# EAGLE design PulseOx (EAGLE 7.1.0)
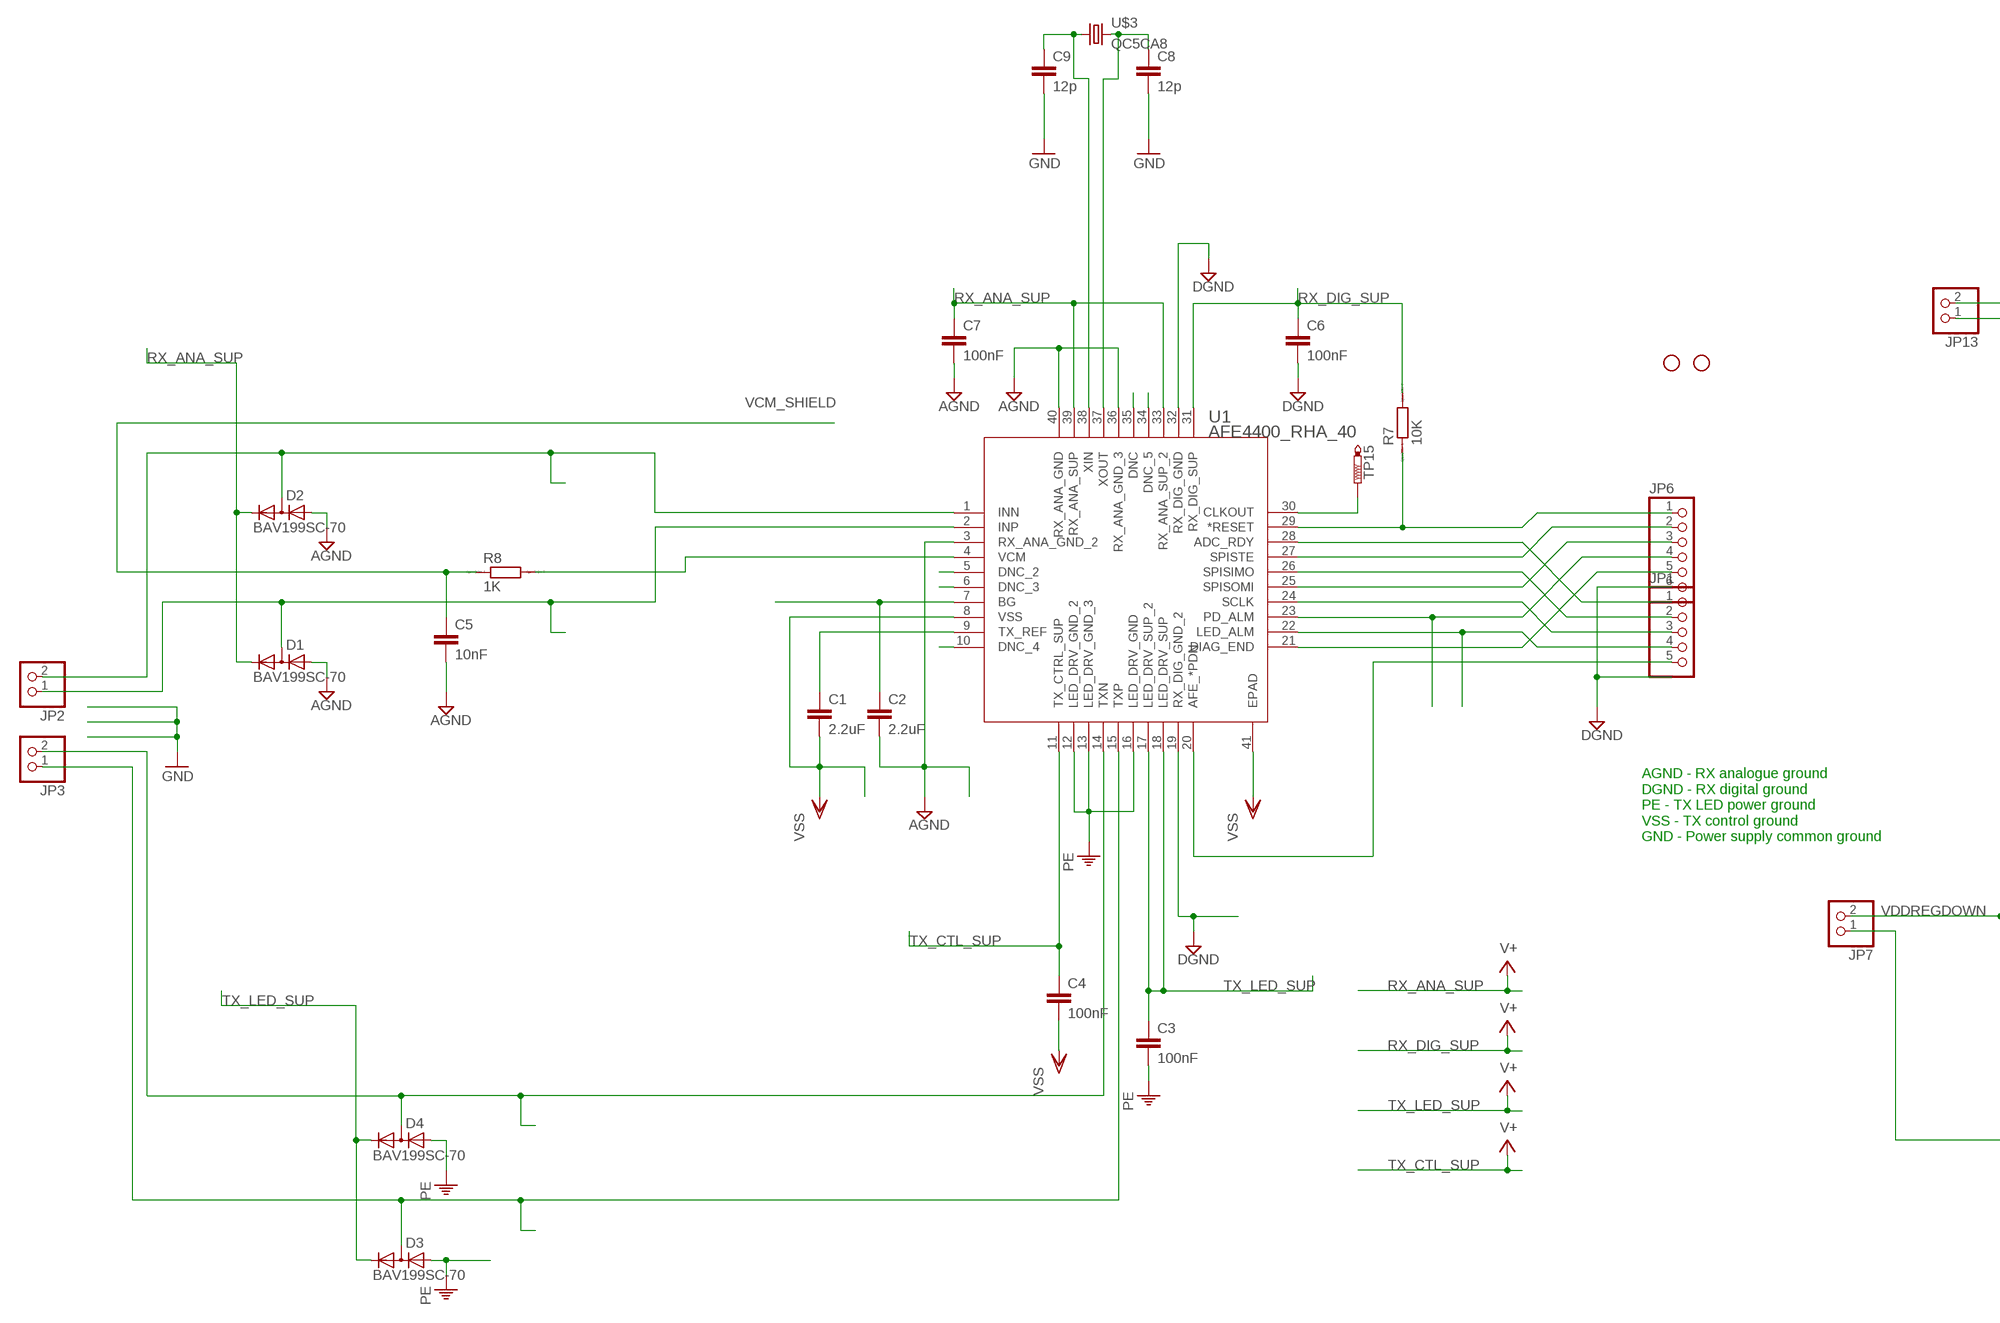
[diagram p0: schematic, sheet 1, part 1 of 2]
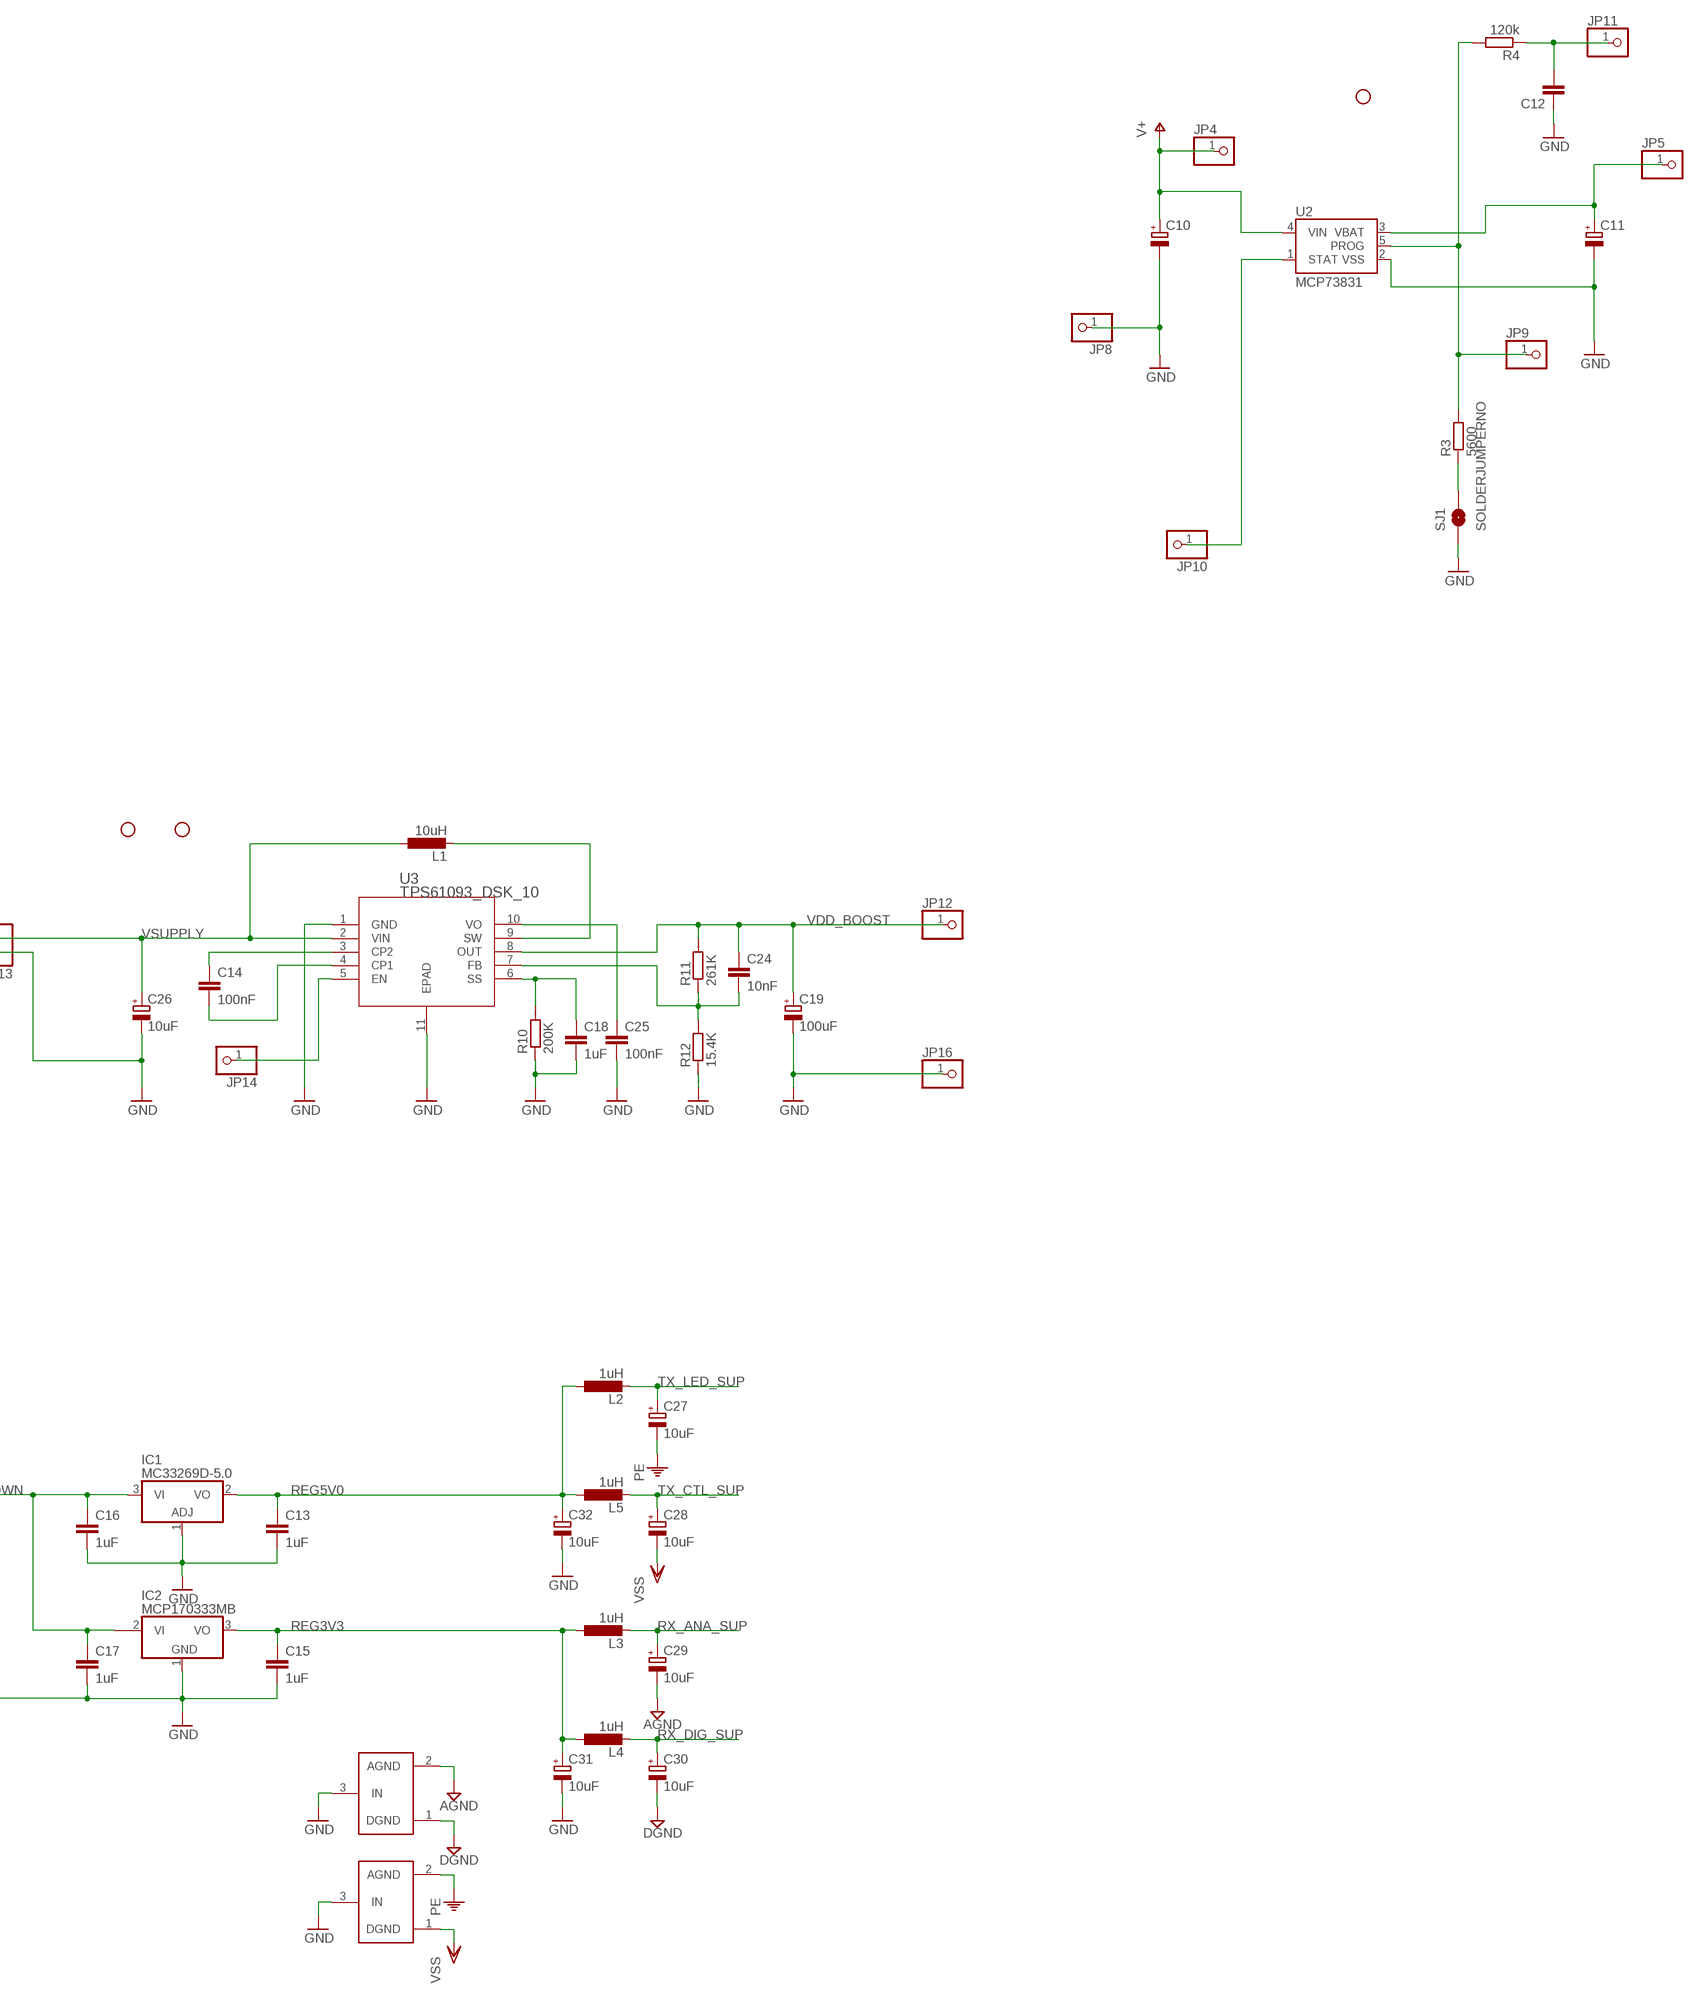
[diagram p1: schematic, sheet 1, part 2 of 2]

## Parts
C1  2.2uF  C-EUC1206K  [C1206K]
C2  2.2uF  C-EUC1206K  [C1206K]
C3  100nF  C-EUC1206K  [C1206K]
C4  100nF  C-EUC1206K  [C1206K]
C5  10nF  C-EUC0603K  [C0603K]
C6  100nF  C-EUC1206K  [C1206K]
C7  100nF  C-EUC1206K  [C1206K]
C8  12p  C-EUC0603K  [C0603K]
C9  12p  C-EUC0603K  [C0603K]
C10  CPOL-EUE2.5-6  [E2,5-6]
C11  CPOL-EUE2.5-6  [E2,5-6]
C12  C-EUC1206  [C1206]
C13  1uF  C-EUC1206K  [C1206K]
C14  100nF  C-EUC1206K  [C1206K]
C15  1uF  C-EUC1206K  [C1206K]
C16  1uF  C-EUC1206K  [C1206K]
C17  1uF  C-EUC1206K  [C1206K]
C18  1uF  C-EUC1206K  [C1206K]
C19  100uF  CPOL-EUTT2D5  [TT2D5]
C24  10nF  C-EUC0603K  [C0603K]
C25  100nF  C-EUC1206K  [C1206K]
C26  10uF  CPOL-EUTT2D5  [TT2D5]
C27  10uF  CPOL-EUTT2D5  [TT2D5]
C28  10uF  CPOL-EUTT2D5  [TT2D5]
C29  10uF  CPOL-EUTT2D5  [TT2D5]
C30  10uF  CPOL-EUTT2D5  [TT2D5]
C31  10uF  CPOL-EUTT2D5  [TT2D5]
C32  10uF  CPOL-EUTT2D5  [TT2D5]
D1  BAV199SC-70  [SC-70]
D2  BAV199SC-70  [SC-70]
D3  BAV199SC-70  [SC-70]
D4  BAV199SC-70  [SC-70]
IC1  MC33269D-5.0  [DPACK]
IC2  MCP170333MB  [SOT89]
JP1  PINHD-1X5  [1X05]
JP2  PINHD-1X2  [1X02]
JP3  PINHD-1X2  [1X02]
JP4  PINHD-1X1  [1X01]
JP5  PINHD-1X1  [1X01]
JP6  PINHD-1X6  [1X06]
JP7  PINHD-1X2  [1X02]
JP8  PINHD-1X1  [1X01]
JP9  PINHD-1X1  [1X01]
JP10  PINHD-1X1  [1X01]
JP11  PINHD-1X1  [1X01]
JP12  PINHD-1X1  [1X01]
JP13  PINHD-1X2  [1X02]
JP14  PINHD-1X1  [1X01]
JP16  PINHD-1X1  [1X01]
L1  10uH  L-EUD53LC  [D53LC]
L2  1uH  L-EU  [L1515]
L3  1uH  L-EU  [L1515]
L4  1uH  L-EU  [L1515]
L5  1uH  L-EU  [L1515]
R3  5600  R-EU_R0402  [R0402]
R4  120k  R-EU_R0402  [R0402]
R7  10K  R-EU_R0805  [R0805]
R8  1K  R-EU_R0402  [R0402]
R10  200K  R-EU_R0603  [R0603]
R11  261K  R-EU_R0603  [R0603]
R12  15.4K  R-EU_R0603  [R0603]
SJ1  SOLDERJUMPERNO  [SJ_2S-NO]
STANDOFF1  STAND-OFF  [STAND-OFF]
STANDOFF2  STAND-OFF  [STAND-OFF]
STANDOFF3  STAND-OFF  [STAND-OFF]
STANDOFF4  STAND-OFF  [STAND-OFF]
STANDOFF5  STAND-OFF  [STAND-OFF]
TP15  PTR1TP12R  [TP12R]
U1  AFE4400_RHA_40  [RHA40_4P15X4P15]
U2  MCP73831  [SOT23-5]
U3  TPS61093_DSK_10  [DSK10_2X1P2]
U$1  GND_CONNECT  [GND_CONNECT]
U$2  GND_CONNECT  [GND_CONNECT]
U$3  QC5CA8  [QC5CA]

## Nets
AFE_PDN: JP1.5 U1.20(AFE_*PDN)
AGND: C2.2 C5.2 C7.2 C29.- D1.2(A) D2.2(A) U1.3(RX_ANA_GND_2) U1.36(RX_ANA_GND_3) U1.40(RX_ANA_GND) U$1.2(AGND)
DGND: C6.2 C30.- JP6.6 U1.19(RX_DIG_GND_2) U1.32(RX_DIG_GND) U$1.1(DGND)
GND: C8.2 C9.2 C13.2 C15.2 C16.2 C17.2 C31.- C32.- IC1.1(ADJ) IC2.1(GND) JP7.1 U$1.3(IN) U$2.3(IN)
GND1: C10.- C11.- C12.1 JP8.1 SJ1.1 U2.2(VSS) ; supply symbol labelled GND
GND2: C18.2 C19.- C25.2 C26.- JP13.1 JP16.1 R10.1 R12.1 U3.1(GND) U3.11(EPAD) ; supply symbol labelled GND
INN: D2.3(AC) JP2.2 U1.1(INN)
INP: D1.3(AC) JP2.1 U1.2(INP)
N$1: C2.1 U1.7(BG)
N$2: U1.5(DNC_2)
N$3: U1.6(DNC_3)
N$4: U1.10(DNC_4)
N$5: U1.35(DNC)
N$6: U1.34(DNC_5)
N$7: TP15.TP U1.30(CLKOUT)
N$8: JP6.1 R7.1 U1.29(*RESET)
N$9: JP1.1 U1.28(ADC_RDY)
N$10: JP6.2 U1.27(SPISTE)
N$11: JP1.2 U1.26(SPISIMO)
N$12: JP6.3 U1.25(SPISOMI)
N$13: JP1.3 U1.24(SCLK)
N$14: JP6.4 U1.23(PD_ALM)
N$15: JP1.4 U1.22(LED_ALM)
N$16: JP6.5 U1.21(DIAG_END)
N$19: C1.1 U1.9(TX_REF)
N$23: JP10.1 U2.1(STAT)
N$24: JP9.1 R3.2 R4.2 U2.5(PROG)
N$25: C12.2 JP11.1 R4.1
N$26: R3.1 SJ1.2
N$27: C14.2 U3.4(CP1)
N$28: C14.1 U3.3(CP2)
N$29: L1.P$2 U3.9(SW)
N$30: C24.2 R11.1 R12.2 U3.7(FB)
N$31: C18.1 R10.2 U3.6(SS)
N$32: R8.2 U1.4(VCM)
N$33: C25.1 U3.10(VO)
N$35: JP14.1 U3.5(EN)
N$37: C9.1 U1.38(XIN) U$3.1
N$38: C8.1 U1.37(XOUT) U$3.3
PE: C3.2 C27.- D3.2(A) D4.2(A) U1.12(LED_DRV_GND_2) U1.13(LED_DRV_GND_3) U1.16(LED_DRV_GND) U$2.2(AGND)
REG3V3: C15.1 C31.+ IC2.3(VO) L3.1 L4.1
REG5V0: C13.1 C32.+ IC1.2(VO) L2.1 L5.1
RX_ANA_SUP: C7.1 C29.+ D1.1(C) D2.1(C) L3.2 U1.33(RX_ANA_SUP_2) U1.39(RX_ANA_SUP) ; supply symbol labelled V+
RX_DIG_SUP: C6.1 C30.+ L4.2 R7.2 U1.31(RX_DIG_SUP) ; supply symbol labelled V+
TX_CTL_SUP: C4.1 C28.+ L5.2 U1.11(TX_CTRL_SUP) ; supply symbol labelled V+
TX_LED_SUP: C3.1 C27.+ D3.1(C) D4.1(C) L2.2 U1.17(LED_DRV_SUP_2) U1.18(LED_DRV_SUP) ; supply symbol labelled V+
TXN: D4.3(AC) JP3.2 U1.14(TXN)
TXP: D3.3(AC) JP3.1 U1.15(TXP)
V+: C10.+ JP4.1 U2.4(VIN)
VBATT: C11.+ JP5.1 U2.3(VBAT)
VCM_SHIELD: C5.1 R8.1
VDD_BOOST: C19.+ C24.1 JP12.1 R11.2 U3.8(OUT)
VDDREGDOWN: C16.1 C17.1 IC1.3(VI) IC2.2@1(VI1) JP7.2
VSS: C1.2 C4.2 C28.- U1.8(VSS) U1.41(EPAD) U$2.1(DGND)
VSUPPLY: C26.+ JP13.2 L1.P$1 U3.2(VIN)
Unconnected: IC2.2(VI)

## Notes on the sheet
- AGND - RX analogue ground
  DGND - RX digital ground
  PE - TX LED power ground
  VSS - TX control ground
  GND - Power supply common ground

## Library data of the parts
C1-C9 C12-C18 C24 C25 = rcl:C-EU: CAPACITOR, European symbol
C10 C11 C19 C26-C32 = rcl:CPOL-EU: POLARIZED CAPACITOR, European symbol
D1-D4 = diode:BAV199: DIODE low-leakage double diode
IC1 = linear:MC33269?*: Adjustable Output Low Dropout Voltage Regulator 800 mA Source: http://www.onsemi.com/pub/Collateral/MC33269-D.PDF
IC2 = linear:MCP1703*: 250 mA, 16V, Low Quiescent Current LDO Regulator Source: http://ww1.microchip.com/downloads/en/DeviceDoc/22049b.pdf
JP1 = pinhead:PINHD-1X5: PIN HEADER
JP2 JP3 JP7 JP13 = pinhead:PINHD-1X2: PIN HEADER
JP4 JP5 JP8-JP12 JP14 JP16 = pinhead:PINHD-1X1: PIN HEADER
JP6 = pinhead:PINHD-1X6: PIN HEADER
L1-L5 = rcl:L-EU: INDUCTOR, European symbol
R3 R4 = rcl:R-EU_: RESISTOR, European symbol
R7 R8 R10-R12 = resistor:R-EU_: RESISTOR, European symbol; SPICEPREFIX: R
SJ1 = SparkFun:SOLDERJUMPER: Solder Jumper Standard SMD solder jumper. Used to automate production. Two varients : Normally Open and Normally Closed are the same, but have different paste layers. NC will have a large amount of paste and should jumper during reflow.
STANDOFF1-STANDOFF5 = SparkFun-Electromechanical:STAND-OFF: #4 Stand Off This is the mechanical footprint for a #4 phillips button head screw. Use the keepout ring to avoid running the screw head into surrounding components. SKU : PRT-00447
TP15 = testpad:PTR1: TEST PIN
U1 = TIImport:AFE4400_RHA_40; MANUFACTURER_PART_NUMBER: afe4400_rha_40; VENDOR: Texas Instruments
U2 = SparkFun:MCP73831: Microchip's MCP73831 Miniature single cell, fully integrated Li-Ion, Li-polymer charge management controller http://ww1.microchip.com/downloads/en/DeviceDoc/21984a.pdf
U3 = TIImport:TPS61093_DSK_10; DATASHEETURL: http://www.ti.com/lit/gpn/TPS61093; DESCRIPTION: Low Input, 20V/1.1A Step-Up DC/DC Converter with Integrated Power Diode and Input/Output Isolation; FAMILY_NAME: STEP-UP REGULATOR; GENERIC_PART_NUMBER: TPS61093; INDUSTRY_STD_PKG_TYPE: SON; MANUFACTURER: Texas Instruments; MANUFACTURER_PART_NUMBER: tps61093_dsk_10; PACKAGE_DESIGNATOR: DSK; PIN_COUNT: 10; VENDOR: Texas Instruments
U$1 U$2 = SparkFun-Passives:GND_CONNECT: Use to make a connection of multiple grounds in only one place.
U$3 = crystal:QC5CA8

## Board
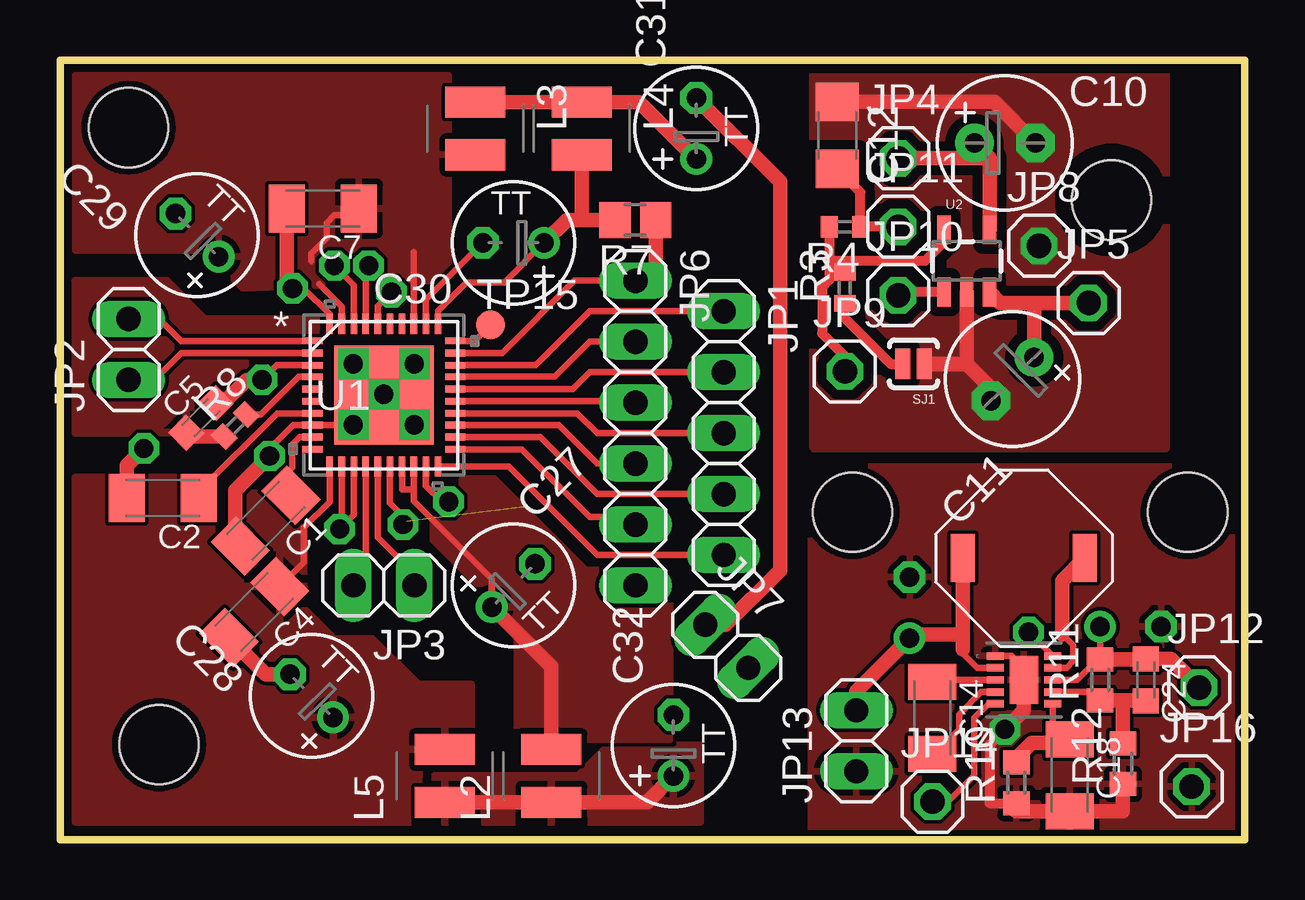
[diagram p2: board, top side]
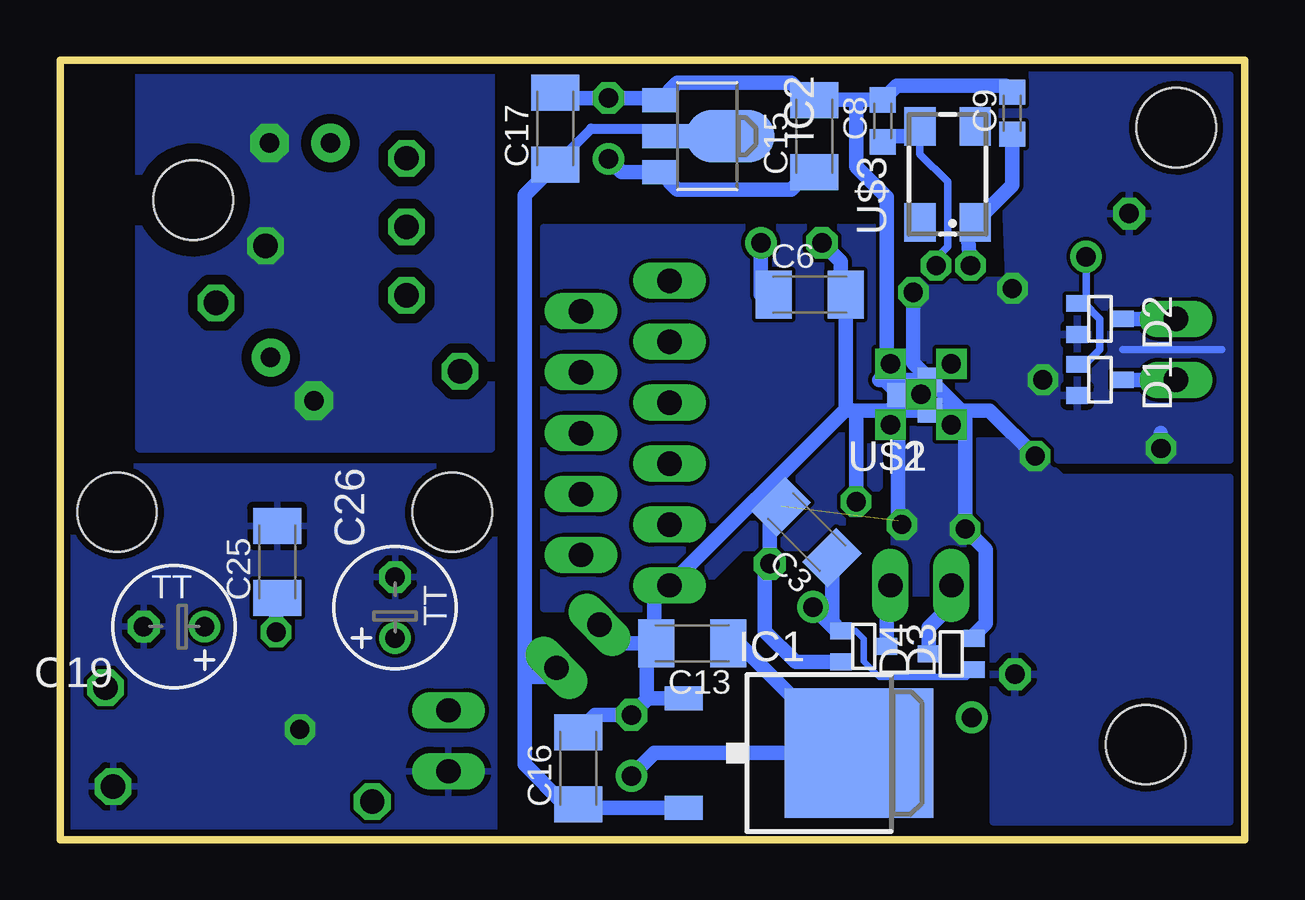
[diagram p3: board, bottom side, seen from below]

Size 49.37 x 32.51 mm. Coordinates in mm from the lower left corner, seen from the top.
Outline: 0,0 49.37,0 49.37,32.51 0,32.51 0,0
Copper layers (1*16): Top 0.035mm / dielectric 1.5mm / Bottom 0.035mm
Design rules "SeeedStudio_2layer_DRU_no_angle_20140221 *": minimum track width 6mil, minimum drill 12mil, track to track 6mil, track to pad 6mil, pad to pad 6mil, via to via 6mil, smd to smd 0mil, copper to edge 10mil, drill to drill 10mil, minimum pad ring 10mil, minimum via ring 6mil, stop-mask expansion 2.75mil, vias tented up to drill 100mil, thermal gap 10mil

### Footprints (pad centres in the part's own frame; a part is rotated, then mirrored left to right if it is on the bottom)
C1206K = smd 1.5 x 2: 1 -1.5,0; 2 1.5,0
C0603K = smd 1.05 x 1.08: 1 -0.875,0; 2 0.875,0
E2,5-6 = drill 0.813 pad 1.6: + -1.27,0 | drill 0.813 pad 1.6 octagon: - 1.27,0
C1206 = smd 1.6 x 1.8: 1 -1.4,0; 2 1.4,0
TT2D5 = drill 0.813: + -1.27,0 | drill 0.813 octagon: - 1.27,0
SC-70 = smd 0.7 x 0.9: 1 -0.65,-0.95; 2 0.65,-0.95; 3 0,0.95
DPACK = smd 1 x 1.6: 1 -2.28,-4.8; 3 2.28,-4.8 | smd 5.4 x 6.2: 2 0,2.5
SOT89 = smd 1 x 1.5: 1 -1.499,-1.981; 3 1.499,-1.981 | smd 1 x 2: 2 0,-1.727 | smd 2.2 x 3.7: 2@1 0,0.94
1X05 = drill 1.016 long: 1 -5.08,0; 2 -2.54,0; 3 0,0; 4 2.54,0; 5 5.08,0
1X02 = drill 1.016 long: 1 -1.27,0; 2 1.27,0
1X01 = drill 1.016 octagon: 1 0,0
1X06 = drill 1.016 long: 1 -6.35,0; 2 -3.81,0; 3 -1.27,0; 4 1.27,0; 5 3.81,0; 6 6.35,0
D53LC = smd 1 x 2: P$1 -2.54,0; P$2 2.54,0
L1515 = smd 1.3 x 2.5: 1 -1.1,0; 2 1.1,0
R0402 = smd 0.7 x 0.9: 1 -0.65,0; 2 0.65,0
R0805 = smd 1.3 x 1.5: 1 -0.85,0; 2 0.85,0
R0603 = smd 1 x 1.1: 1 -0.85,0; 2 0.85,0
SJ_2S-NO = smd 0.635 x 1.27: 1 -0.45,0; 2 0.45,0
STAND-OFF = hole 3.302: 0,0
TP12R = smd 1.2 x 1.2: TP 0,0
RHA40_4P15X4P15 = smd 0.838 x 0.279: 1 -2.972,2.261; 2 -2.972,1.753; 3 -2.972,1.245; 4 -2.972,0.762; 5 -2.972,0.254; 6 -2.972,-0.254; 7 -2.972,-0.762; 8 -2.972,-1.245; 9 -2.972,-1.753; 10 -2.972,-2.261; 21 2.972,-2.261; 22 2.972,-1.753; 23 2.972,-1.245; 24 2.972,-0.762; 25 2.972,-0.254; 26 2.972,0.254; 27 2.972,0.762; 28 2.972,1.245; 29 2.972,1.753; 30 2.972,2.261 | smd 0.279 x 0.838: 11 -2.261,-2.972; 12 -1.753,-2.972; 13 -1.245,-2.972; 14 -0.762,-2.972; 15 -0.254,-2.972; 16 0.254,-2.972; 17 0.762,-2.972; 18 1.245,-2.972; 19 1.753,-2.972; 20 2.261,-2.972; 31 2.261,2.972; 32 1.753,2.972; 33 1.245,2.972; 34 0.762,2.972; 35 0.254,2.972; 36 -0.254,2.972; 37 -0.762,2.972; 38 -1.245,2.972; 39 -1.753,2.972; 40 -2.261,2.972 | smd 4.14 x 4.14: 41 0,0
SOT23-5 = smd 0.55 x 1.2: 1 -0.95,-1.3; 2 0,-1.3; 3 0.95,-1.3; 4 0.95,1.3; 5 -0.95,1.3
DSK10_2X1P2 = smd 0.711 x 0.305: 1 -1.194,0.991; 2 -1.194,0.508; 3 -1.194,0; 4 -1.194,-0.508; 5 -1.194,-0.991; 6 1.194,-0.991; 7 1.194,-0.508; 8 1.194,0; 9 1.194,0.508; 10 1.194,0.991 | smd 1.194 x 2.007: 11 0,0
GND_CONNECT = smd 1.016 x 1.016: 1 -1.016,0; 2 -1.016,-1.27; 3 0.254,-0.635
QC5CA = smd 1.6 x 1.3: 1 -2,-1.15; 2 2,-1.15; 3 2,1.15; 4 -2,1.15

### Placement (x,y rotation side)
C1  8.57,13.3 225 top
C2  4.29,14.26 180 top
C3  18.26,12.83 135 bottom
C4  8.1,9.49 225 top
C5  5.87,17.59 45 top
C6  18.13,22.73 0 bottom
C7  10.95,26.32 180 top
C8  15.08,29.97 90 bottom
C9  9.68,30.29 90 bottom
C10  39.37,29.05 0 top
C11  39.69,19.21 225 top
C12  32.38,29.37 270 top
C13  23.02,8.19 180 bottom
C14  36.35,5.08 270 top
C15  17.94,29.34 90 bottom
C16  27.78,2.98 90 bottom
C17  28.73,29.65 90 bottom
C18  42.07,2.7 270 top
C19  44.61,8.89 180 bottom
C24  45.24,6.67 270 top
C25  40.32,11.59 90 bottom
C26  35.4,9.68 90 bottom
C27  18.89,10.6 45 top
C28  10.48,6 135 top
C29  5.71,25.21 135 top
C30  18.89,24.89 180 top
C31  26.51,29.65 90 top
C32  25.56,3.94 90 top
D1  6.03,19.18 270 bottom
D2  6.03,21.72 270 bottom
D3  15.88,8.06 270 bottom
D4  12.22,7.75 90 bottom
IC1  18.57,3.62 270 bottom
IC2  22.38,29.34 270 bottom
JP1  27.65,16.95 270 top
JP2  2.86,20.45 90 top
JP3  13.49,10.6 180 top
JP4  34.92,28.42 0 top
JP5  42.86,22.38 0 top
JP6  23.97,16.95 270 top
JP7  27.78,8.06 315 top
JP8  40.8,24.77 0 top
JP9  32.7,19.53 0 top
JP10  34.92,22.7 0 top
JP11  34.92,25.56 0 top
JP12  47.47,6.35 0 top
JP13  33.18,4.13 90 top
JP14  36.35,1.59 0 top
JP16  47.15,2.22 0 top
L1  40.16,11.75 0 top
L2  20.48,2.67 90 top
L3  17.3,29.65 270 top
L4  21.75,29.65 270 top
L5  16.03,2.67 90 top
R3  32.7,23.02 90 top
R4  32.7,25.56 180 top
R7  23.97,25.84 180 top
R8  7.3,17.27 45 top
R10  39.85,2.38 90 top
R11  43.34,6.67 90 top
R12  44.29,3.17 90 top
SJ1  35.56,19.84 180 top
STANDOFF1  4.13,3.97 0 top
STANDOFF2  2.86,29.69 0 top
STANDOFF3  43.81,26.67 0 top
STANDOFF4  33.02,13.65 0 top
STANDOFF5  46.99,13.65 0 top
TP15  17.94,21.46 0 top
U1  13.49,18.54 0 top
U2  37.78,24.13 0 top
U3  40.16,6.67 0 top
U$1  14.13,17.91 180 bottom
U$2  14.13,17.91 180 bottom
U$3  12.38,27.75 90 bottom

### Tracks (layer width: path | path; a pad name or v marks a point on that pad's centre or on a via)
AFE_PDN
  Top 0.279: JP1.5 22.38,11.87 18.69,15.57 U1.20
AGND  (via drill 0.8 pad 1.27)
  Top 0.279: U1.3 9.02,19.79 v8.41,19.18 | U1.40 11.23,21.91 10.16,22.99 v9.68,22.99 | U1.36 13.24,22.26 v13.81,22.83
  Top 0.61: v8.41,19.18 7.78,19.18 6.81,18.21 C5.2 | C2.2 2.79,15.61 v3.49,16.32 | v9.68,22.99 9.45,23.22 C7.2
  Bottom 0.318: 5.08,20.45 0.95,20.45
  Bottom 0.61: v13.81,22.83 13.81,19.88 U$1.2 | v3.49,16.32 3.49,16.95
  pour Bottom: 0.64,15.84 0.64,31.88 10.16,31.88 9.84,23.3 13.81,23.3 13.81,17.59 9.53,17.59 7.78,15.84
DGND  (via drill 0.8 pad 1.27)
  Top 0.279: U1.32 15.25,22.52 C30.- | U1.19 15.25,14.76 15.91,14.1 v16.19,14.1
  Bottom 0.61: 16.63,22.86 C6.2 | 16.63,17.91 16.19,17.91 | 16.19,17.91 U$1.1 | C30.- 16.83,24.1 16.83,23.5 16.63,23.3 C6.2 | 16.63,17.91 C6.2 | 16.63,17.91 16.67,17.91 JP6.6 24.61,9.97 24.61,8.1 | v16.19,14.1 16.19,17.91
FGHF
  pour Bottom (rank 4): 15.24,25.53 29.21,25.53 29.21,9.65 23.5,9.65 20.95,12.19 17.78,12.19 15.24,14.73
GND
  Top 0.61: C31.- 30,27.43 30,11.24 27.73,8.96 JP7.1
  Bottom 0.61: C17.2 28.5,30.92 C31.- 24.36,30.92 IC2.1 23.64,31.56 18.89,31.56 18.57,31.24 18.34,31.24 C15.2 17.93,30.85 16.19,30.85 | 24.87,5.9 C32.- 27.06,5.21 C16.2 | 24.87,5.9 IC1.1 | 16.19,30.85 16.19,28.07 14.92,26.8 14.92,19.08 U$2.3 | 16.19,30.85 C8.2 14.5,31.43 9.95,31.43 C9.2 | JP7.1 26.11,8.19 C13.2 24.92,7.78 24.92,5.96 24.87,5.9
GND1
  Top 0.61: SJ1.1 37.78,19.84 | C12.1 38.92,30.77 C10.- | U2.2 37.78,19.84 | C11.- 38.79,18.84 37.78,19.84
  pour Top (isolate 0.406, no thermals): 31.43,16.35 31.43,32.23 46.04,32.23 46.04,16.35
  pour Bottom (isolate 0.406, no thermals): 31.43,16.35 31.43,32.23 46.04,32.23 46.04,16.35
GND2  (via drill 0.8 pad 1.27)
  Top 0.279: U3.1 39.65,7.66 40.01,7.3 40.01,6.83 U3.11
  Top 0.406: v39.37,4.6 38.73,3.97 38.73,1.53 R10.1
  Top 0.61: R10.1 39.85,1.2 C18.2 44.29,1.2 R12.1 | U3.11 40.16,5.4 v39.37,4.6
  pour Bottom: 31.27,15.56 49.05,15.56 49.05,0.32 31.27,0.32
  pour Top: 31.27,15.56 49.05,15.56 49.05,0.32 31.27,0.32
INN
  Top 0.279: U1.1 5.04,20.8 4.13,21.72 JP2.2
  Bottom 0.61: D2.3 JP2.2
INP
  Top 0.279: U1.2 5.04,20.3 3.92,19.18 JP2.1
  Bottom 0.61: D1.3 JP2.1
N$1
  Top 0.279: U1.7 9.05,17.78 5.79,14.52 C2.1
  Top 0.61: 6.19,14.73 6.19,14.66 C2.1
N$7
  Top 0.279: U1.30 17.28,20.8 TP15.TP
N$8
  Top 0.279: U1.29 18.42,20.3 21.43,23.3 JP6.1
  Top 0.61: R7.1 24.82,23.3 JP6.1
N$9
  Top 0.279: U1.28 19.82,19.79 22.07,22.04 JP1.1
N$10
  Top 0.279: U1.27 20.61,19.3 22.07,20.77 JP6.2
N$11
  Top 0.279: U1.26 21.37,18.8 22.07,19.49 JP1.2
N$12
  Top 0.279: U1.25 23.91,18.29 JP6.3
N$13
  Top 0.279: U1.24 21.56,17.78 22.38,16.95 JP1.3
N$14
  Top 0.279: U1.23 20.77,17.3 22.38,15.68 JP6.4
N$15
  Top 0.279: U1.22 20.01,16.79 22.38,14.41 JP1.4
N$16
  Top 0.279: U1.21 19.25,16.28 22.07,13.46 23.65,13.46 JP6.5
N$17  (via drill 0.8 pad 1.27)
  other vias: 12.22,19.84
N$18  (via drill 0.8 pad 1.27)
  other vias: 12.22,17.3
N$19
  Top 0.279: U1.9 9.99,16.79 9.68,16.48 9.68,15.53 9.53,15.37 9.53,14.47
  Top 0.61: 9.53,14.47 C1.1
N$20  (via drill 0.8 pad 1.27)
  other vias: 14.76,17.3
N$21  (via drill 0.8 pad 1.27)
  other vias: 14.76,19.84
N$22  (via drill 0.8 pad 1.27)
  other vias: 13.49,18.57
N$23
  Top 0.406: U2.1 35.05,22.83 JP10.1
N$24
  Top 0.406: R4.2 32.05,24.13 | 32.05,24.13 32.05,23.35 31.75,23.05 31.75,21.11 32.7,20.16 JP9.1 | 32.7,24.13 36.04,24.13 36.83,24.93 U2.5 | 32.7,24.13 32.05,24.13 | R3.2 32.7,24.13
N$25
  Top 0.406: C12.2 33.35,27 R4.1 JP11.1
N$26
  Top 0.406: R3.1 32.7,21.75 34.61,19.84 SJ1.2
N$27
  Top 0.279: U3.4 38.39,6.16 37.47,5.24 37.47,4.6 36.83,3.97 36.74,3.97 C14.2
N$28
  Top 0.279: U3.3 36.44,6.67 C14.1
N$29
  Top 0.279: 41.75,8.57 42.23,8.1 42.23,7.46 41.94,7.18 U3.9
  Top 0.61: L1.P$2 41.75,10.79 41.75,8.57
N$30
  Top 0.279: U3.7 43,6.16 R11.1 | 45.22,5.82 C24.2
  Top 0.61: R11.1 44.29,5.82 | 44.29,5.82 45.22,5.82 | R12.2 44.29,5.82
N$31
  Top 0.279: U3.6 41.36,4.04 41.27,4.04
  Top 0.61: C18.1 42.07,4.04 41.27,4.04 40.5,4.04 39.85,3.39 R10.2
N$32
  Top 0.279: U1.4 9.94,19.3 8.37,17.73 R8.2
N$33  (via drill 0.8 pad 1.27)
  Top 0.279: U3.10 v40.36,8.66
  Bottom 0.61: C25.1 40.36,10.09 v40.36,8.66
N$35
  Top 0.279: U3.5 38.7,5.68 38.1,5.08 38.1,2.7 36.99,1.59 JP14.1
N$37  (via drill 0.8 pad 1.27)
  Top 0.279: U1.38 12.25,23.12 v11.43,23.94
  Bottom 0.61: 11.23,25.65 U$3.1 | C9.1 9.68,27.3 U$3.1 | v11.43,23.94 11.59,25.75 U$3.1
N$38  (via drill 0.8 pad 1.27)
  Top 0.279: U1.37 12.73,23.81 v12.86,23.94
  Bottom 0.318: U$3.3 13.53,28.58 12.38,27.43 12.38,24.73 12.86,24.26 v12.86,23.94
  Bottom 0.61: C8.1 14.84,29.34 13.97,29.34 13.56,29.75 U$3.3
PE  (via drill 0.8 pad 1.27)  (1 unrouted)
  Top 0.279: U1.12 11.74,13.04 v11.65,12.95 12.25,13.55 U1.13 | U1.16 13.75,14.03 14.29,13.49 v14.29,13.14
  Bottom 0.61: D4.2 11.27,8.54 10.79,9.02 10.79,12.1 v11.65,12.95 11.65,17.72 U$2.2 15.24,19.18 | D3.2 18.72,7.42 20,8.7 20,11.29 C27.- 19.79,13.41 C3.2 | 13.34,19.05 14.45,17.94 14.45,13.3 v14.29,13.14
  pour Bottom (rank 3): 11.75,17.91 11.75,10.29 14.61,10.29 14.61,17.91
REG3V3
  Top 0.61: C31.+ 24.14,30.75 L4.1 L3.1
  Bottom 0.61: C15.1 18.34,27.43 18.57,27.43 18.89,27.11 23.64,27.11 IC2.3 25.96,27.84 C31.+
REG5V0
  Top 0.61: C32.+ 24.46,1.57 L2.1 L5.1
  Bottom 0.61: C32.+ 24.61,3.62 18.73,3.62 | 18.73,3.62 IC1.2 | C13.1 21.08,8.19 18.73,5.84 18.73,3.62
  pour Top (rank 4): 26.67,3.94 22.86,3.94 21.59,2.67 15.62,2.67 15.62,0.76 26.67,0.76
RX_ANA_SUP
  Top 0.279: U1.33 14.74,24.5 | U1.39 11.74,22.23 10.79,23.18 | C7.1 12.17,26.04 11.43,26.04 11.11,25.72 11.11,25.08 10.48,24.45 10.48,24.13
  Bottom 0.318: D2.1 6.97,22.35 | D1.1 6.65,19.83 6.03,20.45 6.03,21.72 6.68,22.37 D2.1 | C29.+ 6.61,22.37 D2.1
  pour Top (rank 2): 16.19,31.88 0.64,31.88 0.64,24.57 6.03,24.57 7.62,22.99 16.19,23.3
RX_DIG_SUP
  Top 0.279: U1.31 15.75,22.07 16.92,23.24 18.51,23.24 C30.+
  Top 0.61: C30.+ 21.11,25.84 21.75,25.84 | 21.75,25.84 R7.2 | L4.2 21.75,25.84
  Bottom 0.61: C30.+ 20.16,22.73 C6.1
TX_CTL_SUP
  Top 0.279: C4.1 10.16,11.56 10.16,12.7 10.16,12.83 10.16,13.02 11.23,14.09 U1.11
  pour Top (rank 2): 0.64,15.11 10.16,15.11 10.16,9.65 11.43,8.38 13.02,8.38 14.92,6.48 17.14,6.48 17.14,4.45 14.99,4.45 14.92,0.76 0.64,0.76
TX_LED_SUP
  Top 0.279: U1.17 14.26,14.61 14.74,14.61 | 14.74,14.61 14.74,14.12 17.99,10.87 C27.+ | U1.18 14.74,14.61
  Top 0.61: L2.2 20.48,7.22 C27.+
  Bottom 0.279: D3.1 16.21,8.71 15.88,8.38 15.88,7.43 15.24,6.79 11.58,6.79 D4.1
  Bottom 0.61: C27.+ 17,8.71 D3.1 17.2,9.09 C3.1
  pour Top (rank 3): 19.05,4.19 19.05,9.02 15.56,12.51 15.56,13.78 16.83,15.05 18.1,15.05 21.91,11.24 25.4,11.24 25.4,4.19
TXN
  Top 0.279: U1.14 12.73,11.11 JP3.2
  Bottom 0.61: D4.3 13.17,8.86 12.22,9.81 JP3.2
TXP
  Top 0.279: U1.15 13.24,12.61 14.76,11.08 JP3.1
  Bottom 0.61: JP3.1 14.93,10.44 D3.3
V+
  Top 0.61: U2.4 38.73,28.42 38.58,28.57 | 38.58,28.57 C10.+ | JP4.1 38.42,28.42 38.58,28.57
VBATT
  Top 0.61: JP5.1 40.64,22.38 | 40.64,22.38 39.18,22.38 U2.3 | C11.+ 40.59,22.33 40.64,22.38
VCM_SHIELD
  Top 0.61: 5.25,16.78 C5.1 5.41,16.81 R8.1
  pour Top: 0.64,23.3 4.45,23.3 6.03,21.72 10.67,21.72 10.64,19.81 8.41,19.81 5.56,16.95 0.64,16.95
VDD_BOOST
  Top 0.279: U3.8 42.39,6.67 43.24,7.52 R11.2 C19.+ | C24.1 45.22,7.52
  Top 0.61: 45.22,7.52 R11.2 | C24.1 46.27,7.54 JP12.1
VDDREGDOWN
  Bottom 0.406: C17.1 27.23,29.65 21.76,29.65
  Bottom 0.61: 30,6.79 30,26.88 C17.1 | 30,6.79 30,3.14 28.34,1.48 C16.1 27.78,1.34 IC1.3 | 21.76,29.65 IC2.2@1 | JP7.2 29.05,6.79 30,6.79
VSS  (via drill 0.8 pad 1.27)
  Top 0.279: 12.25,17.3 U1.8 9.71,17.3 8.73,16.32 v8.73,16
  Top 0.61: v8.73,16 7.3,14.57 7.3,12.45 C1.2 | 12.25,17.3 U1.41 | C4.2 8.57,6.9 C28.-
  Bottom 0.61: v8.73,16 10.64,17.91 U$2.1
  pour Bottom (rank 2): 11.11,16.64 9.21,16.64 7.62,15.11 0.64,15.11 0.64,0.76 10.48,0.76 10.48,11.56 11.11,12.19
VSUPPLY
  Top 0.279: U3.2 38.23,7.18 37.62,7.78 37.62,8.26
  Top 0.61: 37.62,7.94 37.62,8.26 37.62,8.57 | 37.62,8.57 L1.P$1 | 37.62,8.57 35.56,8.57 C26.+ 33.18,6.19 JP13.2